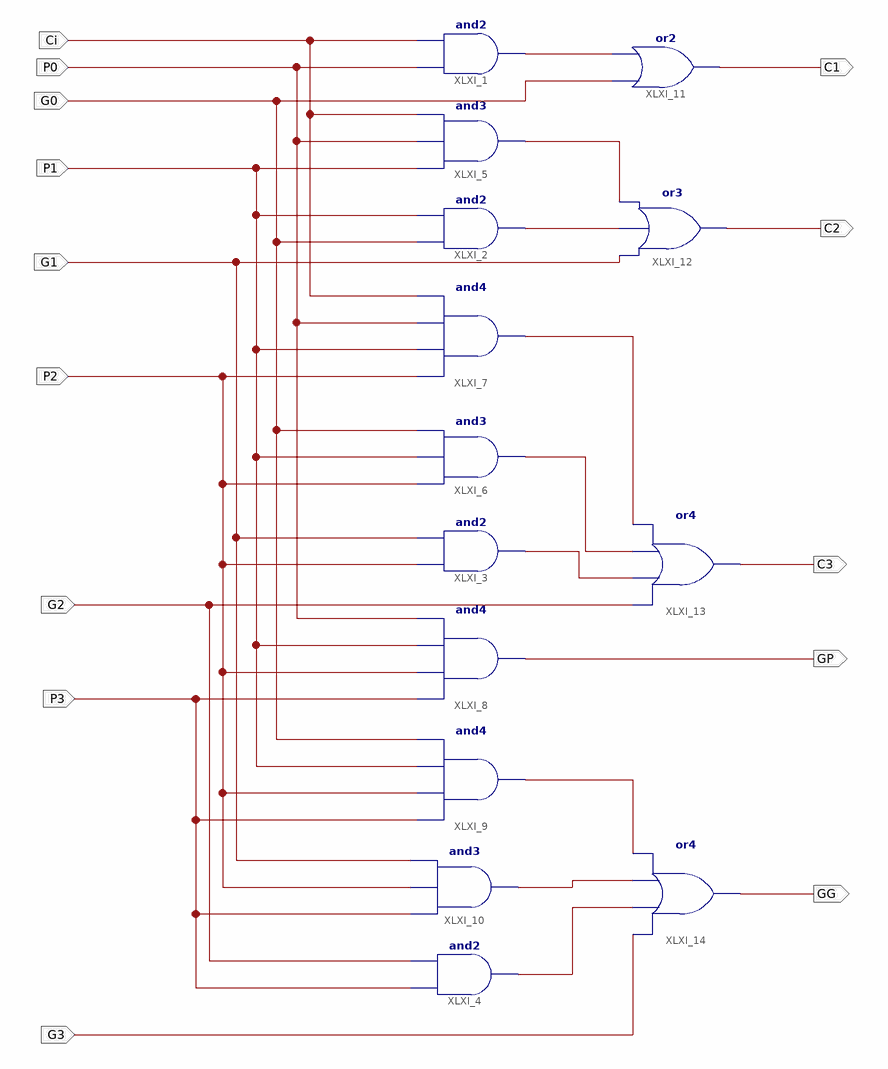
[diagram p0: schematic sheet 1]
// Xilinx ISE schematic CLA.sch (kintex7) as structural Verilog: 14 symbols, 14 ports
module CLA (
  input  Ci,
  input  P0,
  input  G0,
  input  P1,
  input  G1,
  input  P2,
  input  G2,
  input  P3,
  input  G3,
  output GP,
  output GG,
  output C1,
  output C2,
  output C3
);

  wire XLXN_1, XLXN_13, XLXN_14, XLXN_15, XLXN_18, XLXN_19, XLXN_20, XLXN_21, XLXN_22;

  and XLXI_1 (XLXN_1, P0, Ci);
  and XLXI_2 (XLXN_21, G0, P1);
  and XLXI_3 (XLXN_18, P2, G1);
  and XLXI_4 (XLXN_13, P3, G2);
  and XLXI_5 (XLXN_22, P1, P0, Ci);
  and XLXI_6 (XLXN_19, P2, P1, G0);
  and XLXI_7 (XLXN_20, P2, P1, P0, Ci);
  and XLXI_8 (GP, P3, P2, P1, P0);
  and XLXI_9 (XLXN_15, P3, P2, P1, G0);
  and XLXI_10 (XLXN_14, P3, P2, G1);
  or XLXI_11 (C1, G0, XLXN_1);
  or XLXI_12 (C2, G1, XLXN_21, XLXN_22);
  or XLXI_13 (C3, G2, XLXN_18, XLXN_19, XLXN_20);
  or XLXI_14 (GG, G3, XLXN_13, XLXN_14, XLXN_15);
endmodule
